# EAGLE design TPLE (EAGLE 6.4)
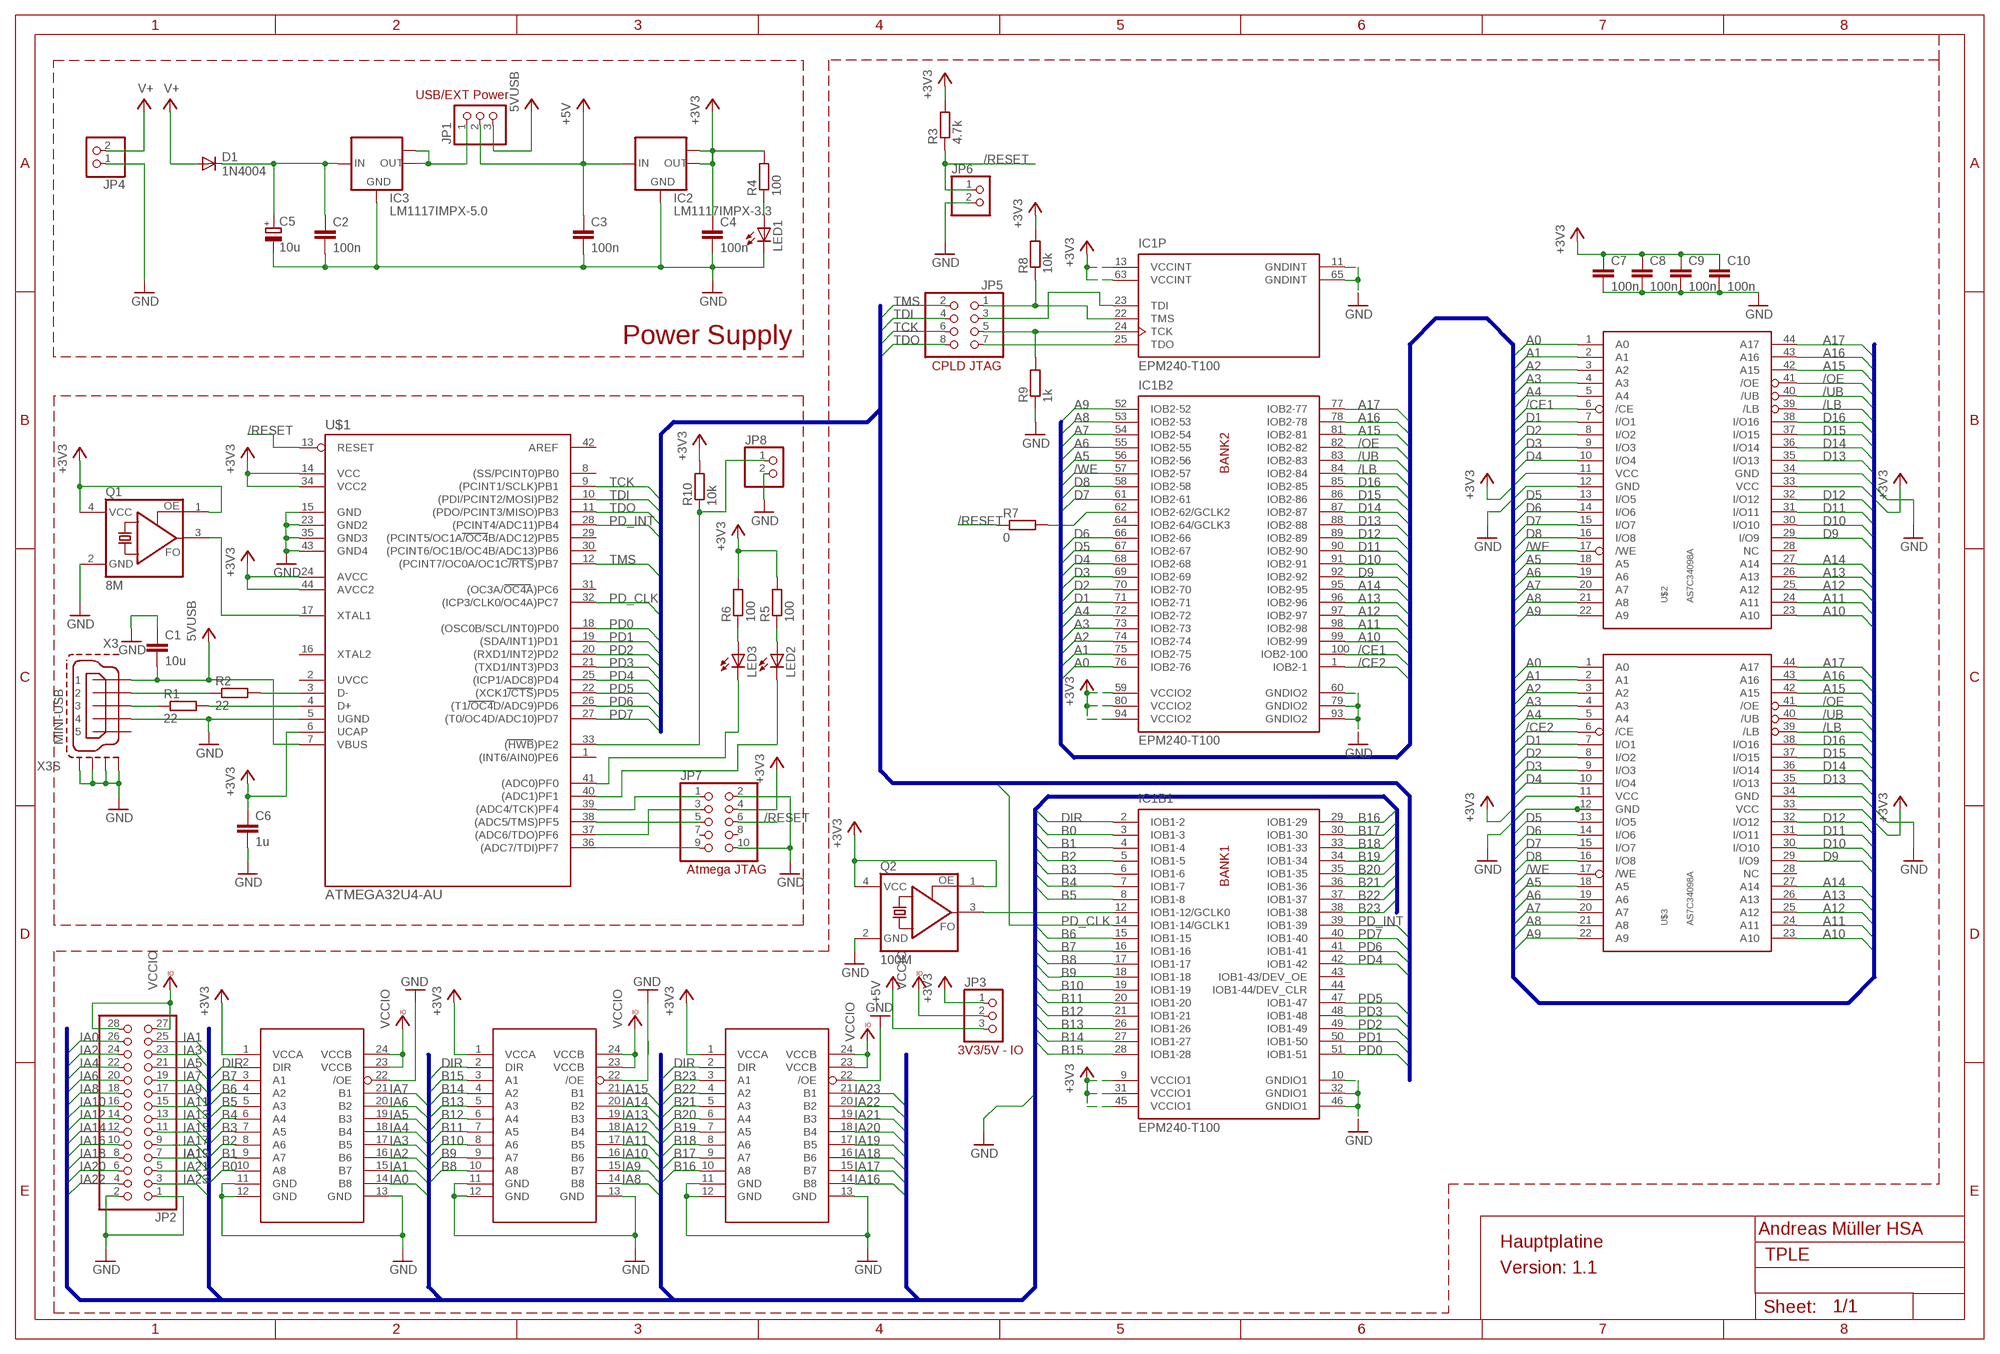
[diagram p0: schematic, sheet 1]

## Parts
C1  10u  C-EUC3216  [C3216]
C2  100n  C-EUC1206  [C1206]
C3  100n  C-EUC1206  [C1206]
C4  100n  C-EUC1206  [C1206]
C5  10u  CPOL-EUE2-5  [E2-5]
C6  1u  C-EUC0402  [C0402]
C7  100n  C-EUC0402  [C0402]
C8  100n  C-EUC0402  [C0402]
C9  100n  C-EUC0402  [C0402]
C10  100n  C-EUC0402  [C0402]
D1  1N4004  [DO41-10]
IC1  EPM240-T100  [TQFP100]
IC2  LM1117IMPX-3.3  [SOT223]
IC3  LM1117IMPX-5.0  [SOT223]
JP1  PINHD-1X3  [1X03]
JP2  PINHD-2X14  [2X14]
JP3  PINHD-1X3  [1X03]
JP4  PINHD-1X2  [1X02]
JP5  PINHD-2X4  [2X04]
JP6  PINHD-1X2  [1X02]
JP7  PINHD-2X5  [2X05]
JP8  PINHD-1X2  [1X02]
LED1  LEDSMT1206  [1206]
LED2  LEDSMT1206  [1206]
LED3  LEDSMT1206  [1206]
Q1  8M  ASFL1  [ASF]
Q2  100M  ASFL1  [ASF]
R1  22  R-EU_M3216  [M3216]
R2  22  R-EU_M3216  [M3216]
R3  4.7k  R-EU_M3216  [M3216]
R4  100  R-EU_M3216  [M3216]
R5  100  R-EU_M3216  [M3216]
R6  100  R-EU_M3216  [M3216]
R7  0  R-EU_R0201  [R0201]
R8  10k  R-EU_M3216  [M3216]
R9  1k  R-EU_M3216  [M3216]
R10  10k  R-EU_R0402  [R0402]
U$1  ATMEGA32U4-AU  [TQFP44]
U$2  AS7C34098A  [TSOP44-T2]
U$3  AS7C34098A  [TSOP44-T2]
U$4  SN74LVC8T245  [TVSOP24]
U$5  SN74LVC8T245  [TVSOP24]
U$6  SN74LVC8T245  [TVSOP24]
X3  MINI-USB  MINI-USB-SHIELD-UX60A-MB-5ST  [UX60A-MB-5ST]

## Nets
+3V3: C4.1 C6.1 C7.1 C8.1 C9.1 C10.1 IC1.9(B1:VCCIO1) IC1.13(P:VCCINT) IC1.31(B1:VCCIO1) IC1.45(B1:VCCIO1) IC1.59(B2:VCCIO2) IC1.63(P:VCCINT) IC1.80(B2:VCCIO2) IC1.94(B2:VCCIO2) IC2.2(OUT) IC2.TAB(OUT1) JP3.1 JP7.4 Q1.1(OE) Q1.4(VCC) Q2.1(OE) Q2.4(VCC) R3.2 R4.2 R5.2 R6.2 R8.2 R10.2 U$1.6(UCAP) U$1.14(VCC) U$1.24(AVCC) U$1.34(VCC2) U$1.44(AVCC2) U$2.11(VCC) U$2.33(VCC) U$3.11(VCC) U$3.33(VCC) U$4.1(VCCA) U$5.1(VCCA) U$6.1(VCCA)
+5V: C3.1 IC2.3(IN) JP1.2 JP3.3
/CE1: IC1.100(B2:IOB2-100) U$2.6(/CE)
/CE2: IC1.1(B2:IOB2-1) U$3.6(/CE)
/LB: IC1.84(B2:IOB2-84) U$2.39(/LB) U$3.39(/LB)
/OE: IC1.82(B2:IOB2-82) U$2.41(/OE) U$3.41(/OE)
/RESET: JP6.1 JP7.6 R3.1 R7.1 U$1.13(RESET)
/UB: IC1.83(B2:IOB2-83) U$2.40(/UB) U$3.40(/UB)
/WE: IC1.57(B2:IOB2-57) U$2.17(/WE) U$3.17(/WE)
A0: IC1.76(B2:IOB2-76) U$2.1(A0) U$3.1(A0)
A1: IC1.75(B2:IOB2-75) U$2.2(A1) U$3.2(A1)
A2: IC1.74(B2:IOB2-74) U$2.3(A2) U$3.3(A2)
A3: IC1.73(B2:IOB2-73) U$2.4(A3) U$3.4(A3)
A4: IC1.72(B2:IOB2-72) U$2.5(A4) U$3.5(A4)
A5: IC1.56(B2:IOB2-56) U$2.18(A5) U$3.18(A5)
A6: IC1.55(B2:IOB2-55) U$2.19(A6) U$3.19(A6)
A7: IC1.54(B2:IOB2-54) U$2.20(A7) U$3.20(A7)
A8: IC1.53(B2:IOB2-53) U$2.21(A8) U$3.21(A8)
A9: IC1.52(B2:IOB2-52) U$2.22(A9) U$3.22(A9)
A10: IC1.99(B2:IOB2-99) U$2.23(A10) U$3.23(A10)
A11: IC1.98(B2:IOB2-98) U$2.24(A11) U$3.24(A11)
A12: IC1.97(B2:IOB2-97) U$2.25(A12) U$3.25(A12)
A13: IC1.96(B2:IOB2-96) U$2.26(A13) U$3.26(A13)
A14: IC1.95(B2:IOB2-95) U$2.27(A14) U$3.27(A14)
A15: IC1.81(B2:IOB2-81) U$2.42(A15) U$3.42(A15)
A16: IC1.78(B2:IOB2-78) U$2.43(A16) U$3.43(A16)
A17: IC1.77(B2:IOB2-77) U$2.44(A17) U$3.44(A17)
B0: IC1.3(B1:IOB1-3) U$4.10(A8)
B1: IC1.4(B1:IOB1-4) U$4.9(A7)
B2: IC1.5(B1:IOB1-5) U$4.8(A6)
B3: IC1.6(B1:IOB1-6) U$4.7(A5)
B4: IC1.7(B1:IOB1-7) U$4.6(A4)
B5: IC1.8(B1:IOB1-8) U$4.5(A3)
B6: IC1.15(B1:IOB1-15) U$4.4(A2)
B7: IC1.16(B1:IOB1-16) U$4.3(A1)
B8: IC1.17(B1:IOB1-17) U$5.10(A8)
B9: IC1.18(B1:IOB1-18) U$5.9(A7)
B10: IC1.19(B1:IOB1-19) U$5.8(A6)
B11: IC1.20(B1:IOB1-20) U$5.7(A5)
B12: IC1.21(B1:IOB1-21) U$5.6(A4)
B13: IC1.26(B1:IOB1-26) U$5.5(A3)
B14: IC1.27(B1:IOB1-27) U$5.4(A2)
B15: IC1.28(B1:IOB1-28) U$5.3(A1)
B16: IC1.29(B1:IOB1-29) U$6.10(A8)
B17: IC1.30(B1:IOB1-30) U$6.9(A7)
B18: IC1.33(B1:IOB1-33) U$6.8(A6)
B19: IC1.34(B1:IOB1-34) U$6.7(A5)
B20: IC1.35(B1:IOB1-35) U$6.6(A4)
B21: IC1.36(B1:IOB1-36) U$6.5(A3)
B22: IC1.37(B1:IOB1-37) U$6.4(A2)
B23: IC1.38(B1:IOB1-38) U$6.3(A1)
D1: IC1.71(B2:IOB2-71) U$2.7(I/O1) U$3.7(I/O1)
D2: IC1.70(B2:IOB2-70) U$2.8(I/O2) U$3.8(I/O2)
D3: IC1.69(B2:IOB2-69) U$2.9(I/O3) U$3.9(I/O3)
D4: IC1.68(B2:IOB2-68) U$2.10(I/O4) U$3.10(I/O4)
D5: IC1.67(B2:IOB2-67) U$2.13(I/O5) U$3.13(I/O5)
D6: IC1.66(B2:IOB2-66) U$2.14(I/O6) U$3.14(I/O6)
D7: IC1.61(B2:IOB2-61) U$2.15(I/O7) U$3.15(I/O7)
D8: IC1.58(B2:IOB2-58) U$2.16(I/O8) U$3.16(I/O8)
D9: IC1.92(B2:IOB2-92) U$2.29(I/O9) U$3.29(I/O9)
D10: IC1.91(B2:IOB2-91) U$2.30(I/O10) U$3.30(I/O10)
D11: IC1.90(B2:IOB2-90) U$2.31(I/O11) U$3.31(I/O11)
D12: IC1.89(B2:IOB2-89) U$2.32(I/O12) U$3.32(I/O12)
D13: IC1.88(B2:IOB2-88) U$2.35(I/O13) U$3.35(I/O13)
D14: IC1.87(B2:IOB2-87) U$2.36(I/O14) U$3.36(I/O14)
D15: IC1.86(B2:IOB2-86) U$2.37(I/O15) U$3.37(I/O15)
D16: IC1.85(B2:IOB2-85) U$2.38(I/O16) U$3.38(I/O16)
DIR: IC1.2(B1:IOB1-2) U$4.2(DIR) U$5.2(DIR) U$6.2(DIR)
GND: C1.1 C2.2 C3.2 C4.2 C5.- C6.2 C7.2 C8.2 C9.2 C10.2 IC1.10(B1:GNDIO1) IC1.11(P:GNDINT) IC1.32(B1:GNDIO1) IC1.46(B1:GNDIO1) IC1.60(B2:GNDIO2) IC1.65(P:GNDINT) IC1.79(B2:GNDIO2) IC1.93(B2:GNDIO2) IC2.1(GND) IC3.1(GND) JP2.1 JP2.2 JP4.1 JP6.2 JP7.2 JP7.10 JP8.2 LED1.C Q1.2(GND) Q2.2(GND) R9.1 U$1.5(UGND) U$1.15(GND) U$1.23(GND2) U$1.35(GND3) U$1.43(GND4) U$2.12(GND) U$2.34(GND) U$3.12(GND) U$3.34(GND) U$4.11(GND) U$4.12(GND) U$4.13(GND) U$4.22(/OE) U$5.11(GND) U$5.12(GND) U$5.13(GND) U$5.22(/OE) U$6.11(GND) U$6.12(GND) U$6.13(GND) U$6.22(/OE) X3.4 X3.M1(S1) X3.M2(S2) X3.M3(S3) X3.M4(S4)
IA0: JP2.26 U$4.14(B8)
IA1: JP2.25 U$4.15(B7)
IA2: JP2.24 U$4.16(B6)
IA3: JP2.23 U$4.17(B5)
IA4: JP2.22 U$4.18(B4)
IA5: JP2.21 U$4.19(B3)
IA6: JP2.20 U$4.20(B2)
IA7: JP2.19 U$4.21(B1)
IA8: JP2.18 U$5.14(B8)
IA9: JP2.17 U$5.15(B7)
IA10: JP2.16 U$5.16(B6)
IA11: JP2.15 U$5.17(B5)
IA12: JP2.14 U$5.18(B4)
IA13: JP2.13 U$5.19(B3)
IA14: JP2.12 U$5.20(B2)
IA15: JP2.11 U$5.21(B1)
IA16: JP2.10 U$6.14(B8)
IA17: JP2.9 U$6.15(B7)
IA18: JP2.8 U$6.16(B6)
IA19: JP2.7 U$6.17(B5)
IA20: JP2.6 U$6.18(B4)
IA21: JP2.5 U$6.19(B3)
IA22: JP2.4 U$6.20(B2)
IA23: JP2.3 U$6.21(B1)
N$2: R2.1 X3.2
N$3: R2.2 U$1.3(D-)
N$4: R1.1 X3.3
N$5: R1.2 U$1.4(D+)
N$6: IC3.2(OUT) IC3.TAB(OUT1) JP1.1
N$7: IC1.23(P:TDI) JP5.3
N$8: C2.1 C5.+ D1.C IC3.3(IN)
N$9: IC1.22(P:TMS) JP5.1 R8.1
N$10: IC1.24(P:TCK) JP5.5 R9.2
N$11: IC1.25(P:TDO) JP5.7
N$13: JP7.1 U$1.39((ADC4/TCK)PF4)
N$14: JP7.3 U$1.37((ADC6/TDO)PF6)
N$15: JP7.5 U$1.38((ADC5/TMS)PF5)
N$16: JP7.9 U$1.36((ADC7/TDI)PF7)
N$17: IC1.62(B2:IOB2-62/GCLK2) R7.2
N$18: JP8.1 R10.1 U$1.33((HWB)PE2)
N$23: Q1.3(FO) U$1.17(XTAL1)
N$24: IC1.12(B1:IOB1-12/GCLK0) Q2.3(FO)
N$25: LED1.A R4.1
N$26: LED2.C U$1.40((ADC1)PF1)
N$27: LED3.C U$1.41((ADC0)PF0)
N$28: LED2.A R5.1
N$29: LED3.A R6.1
PD0: IC1.51(B1:IOB1-51) U$1.18((OSC0B/SCL/INT0)PD0)
PD1: IC1.50(B1:IOB1-50) U$1.19((SDA/INT1)PD1)
PD2: IC1.49(B1:IOB1-49) U$1.20((RXD1/INT2)PD2)
PD3: IC1.48(B1:IOB1-48) U$1.21((TXD1/INT3)PD3)
PD4: IC1.42(B1:IOB1-42) U$1.25((ICP1/ADC8)PD4)
PD5: IC1.47(B1:IOB1-47) U$1.22((XCK1/CTS)PD5)
PD6: IC1.41(B1:IOB1-41) U$1.26((T1/OC4D/ADC9)PD6)
PD7: IC1.40(B1:IOB1-40) U$1.27((T0/OC4D/ADC10)PD7)
PD_CLK: IC1.14(B1:IOB1-14/GCLK1) U$1.32((ICP3/CLK0/OC4A)PC7)
PD_INT: IC1.39(B1:IOB1-39) U$1.28((PCINT4/ADC11)PB4)
TCK: JP5.6 U$1.9((PCINT1/SCLK)PB1)
TDI: JP5.4 U$1.10((PDI/PCINT2/MOSI)PB2)
TDO: JP5.8 U$1.11((PDO/PCINT3/MISO)PB3)
TMS: JP5.2 U$1.12((PCINT7/OC0A/OC1C/RTS)PB7)
V+: D1.A JP4.2
VCC: C1.2 JP1.3 U$1.7(VBUS) X3.1 ; supply symbol labelled 5VUSB
VCCIO: JP2.27 JP2.28 JP3.2 U$4.23(VCCB) U$4.24(VCCB) U$5.23(VCCB) U$5.24(VCCB) U$6.23(VCCB) U$6.24(VCCB)
Unconnected: IC1.43(B1:IOB1-43/DEV_OE) IC1.44(B1:IOB1-44/DEV_CLR) IC1.64(B2:IOB2-64/GCLK3) JP7.7 JP7.8 U$1.1((INT6/AIN0)PE6) U$1.2(UVCC) U$1.8((SS/PCINT0)PB0) U$1.16(XTAL2) U$1.29((PCINT5/OC1A/OC4B/ADC12)PB5) U$1.30((PCINT6/OC1B/OC4B/ADC13)PB6) U$1.31((OC3A/OC4A)PC6) U$1.42(AREF) U$2.28(NC) U$3.28(NC) X3.5

## Buses
A[0..17],D[1..16],/WE,/LB,/UB,/OE,/CE1,/CE2
PD[0..7],PD_CLK,PD_INT,TDI,TMS,TCK,TDO
IA[0..23],B[0..23],DIR,\OE

## Notes on the sheet
- USB/EXT Power
- Power Supply
- CPLD JTAG
- Atmega JTAG
- 3V3/5V - IO
- Andreas Müller HSA
- Hauptplatine
- Version: 1.1

## Library data of the parts
C1-C4 C6-C10 = rcl:C-EU: CAPACITOR, European symbol
C5 = rcl:CPOL-EU: POLARIZED CAPACITOR, European symbol
D1 = diode:1N4004: DIODE general purpose rectifier, 1 A
IC1 = altera-max2:EPM240-T100: Altera MAX II CPLD - EPM240 TQFP-100 Device EPM240 from Altera MAX II Family Feature EPM240 LEs 240 Typical Equivalent Macrocells 192 Equivalent Macrocell Range 128 ... 240 UFM Size (bits) 8192 User I/O pins 80 tPD1 (ns) 4.7 fCNT (MHz) 304 tSU (ns) 1.7 tCO (ns) 4.3
IC2 IC3 = lm1117:LM1117IMPX-*
JP1 JP3 = pinhead:PINHD-1X3: PIN HEADER
JP2 = pinhead:PINHD-2X14: PIN HEADER
JP4 JP6 JP8 = pinhead:PINHD-1X2: PIN HEADER
JP5 = pinhead:PINHD-2X4: PIN HEADER
JP7 = pinhead:PINHD-2X5: PIN HEADER
LED1-LED3 = led:LED: LED OSRAM: - CHIPLED LG R971, LG N971, LY N971, LG Q971, LY Q971, LO R971, LY R971 LH N974, LH R974 LS Q976, LO Q976, LY Q976 LO Q996 - Hyper CHIPLED LW Q18S LB Q993, LB Q99A, LB R99A - SideLED LS A670, LO A670, LY A670, LG A670, LP A670 LB A673, LV A673, LT A673, LW A673 LH A674 LY A675 LS A676, LA A676, LO A676, LY A676, LW A676 LS A679, LY A679, LG A679 - Hyper Micro SIDELED® LS Y876, LA Y876, LO Y876, LY Y876 LT Y87S - SmartLED LW L88C, LW L88S LB L89C, LB L89S, LG L890 LS L89K, LO L89K, LY L89K LS L896, LA L896, LO L896, LY L896 - TOPLED LS T670, LO T670, LY T670, LG T670, LP T670 LSG T670, LSP T670, LSY T670, LOP T670, LYG T670 LG T671, LOG T671, LSG T671 LB T673, LV T673, LT T673, LW T673 LH T674 LS T676, LA T676, LO T676, LY T676, LB T676, LH T676, LSB T676, LW T676 LB T67C, LV T67C, LT T67C, LS T67K, LO T67K, LY T67K, LW E67C LS E67B, LA E67B, LO E67B, LY E67B, LB E67C, LV E67C, LT E67C LW T67C LS T679, LY T679, LG T679 LS T770, LO T770, LY T770, LG T770, LP T770 LB T773, LV T773, LT T773, LW T773 LH T774 LS E675, LA E675, LY E675, LS T675 LS T776, LA T776, LO T776, LY T776, LB T776 LHGB T686 LT T68C, LB T68C - Hyper Mini TOPLED® LB M676 - Mini TOPLED Santana® LG M470 LS M47K, LO M47K, LY M47K Source: http://www.osram.convergy.de LUXEON: - LUMILED® LXK2-PW12-R00, LXK2-PW12-S00, LXK2-PW14-U00, LXK2-PW14-V00 LXK2-PM12-R00, LXK2-PM12-S00, LXK2-PM14-U00 LXK2-PE12-Q00, LXK2-PE12-R00, LXK2-PE12-S00, LXK2-PE14-T00, LXK2-PE14-U00 LXK2-PB12-K00, LXK2-PB12-L00, LXK2-PB12-M00, LXK2-PB14-N00, LXK2-PB14-P00, LXK2-PB14-Q00 LXK2-PR12-L00, LXK2-PR12-M00, LXK2-PR14-Q00, LXK2-PR14-R00 LXK2-PD12-Q00, LXK2-PD12-R00, LXK2-PD12-S00 LXK2-PH12-R00, LXK2-PH12-S00 LXK2-PL12-P00, LXK2-PL12-Q00, LXK2-PL12-R00 Source: www.luxeon.com KINGBRIGHT: KA-3528ASYC Source: www.kingbright.com
Q1 Q2 = crystal:ASF*: CRYSTAL CLOCK OSCILLATORS 5.0 Vdc or 3.3 Vdc - LOW PROFILE ULTRA MINIATURE CERAMIC SURFACE MOUNT Source: http://www.abracon.com/Oscillators/asf1-L-L1.pdf
R1-R6 R8 R9 = resistor:R-EU_: RESISTOR, European symbol
R7 R10 = rcl:R-EU_: RESISTOR, European symbol
U$1 = mega32U4:ATMEGA32U4-AU
U$2 U$3 = as7c34098a:AS7C34098A
U$4-U$6 = sn47lvc:SN74LVC8T245
X3 = con-hirose:MINI-USB-SHIELD-: MINI USB Connector Source: http://www.hirose.co.jp/cataloge_hp/e24000019.pdf

## Board
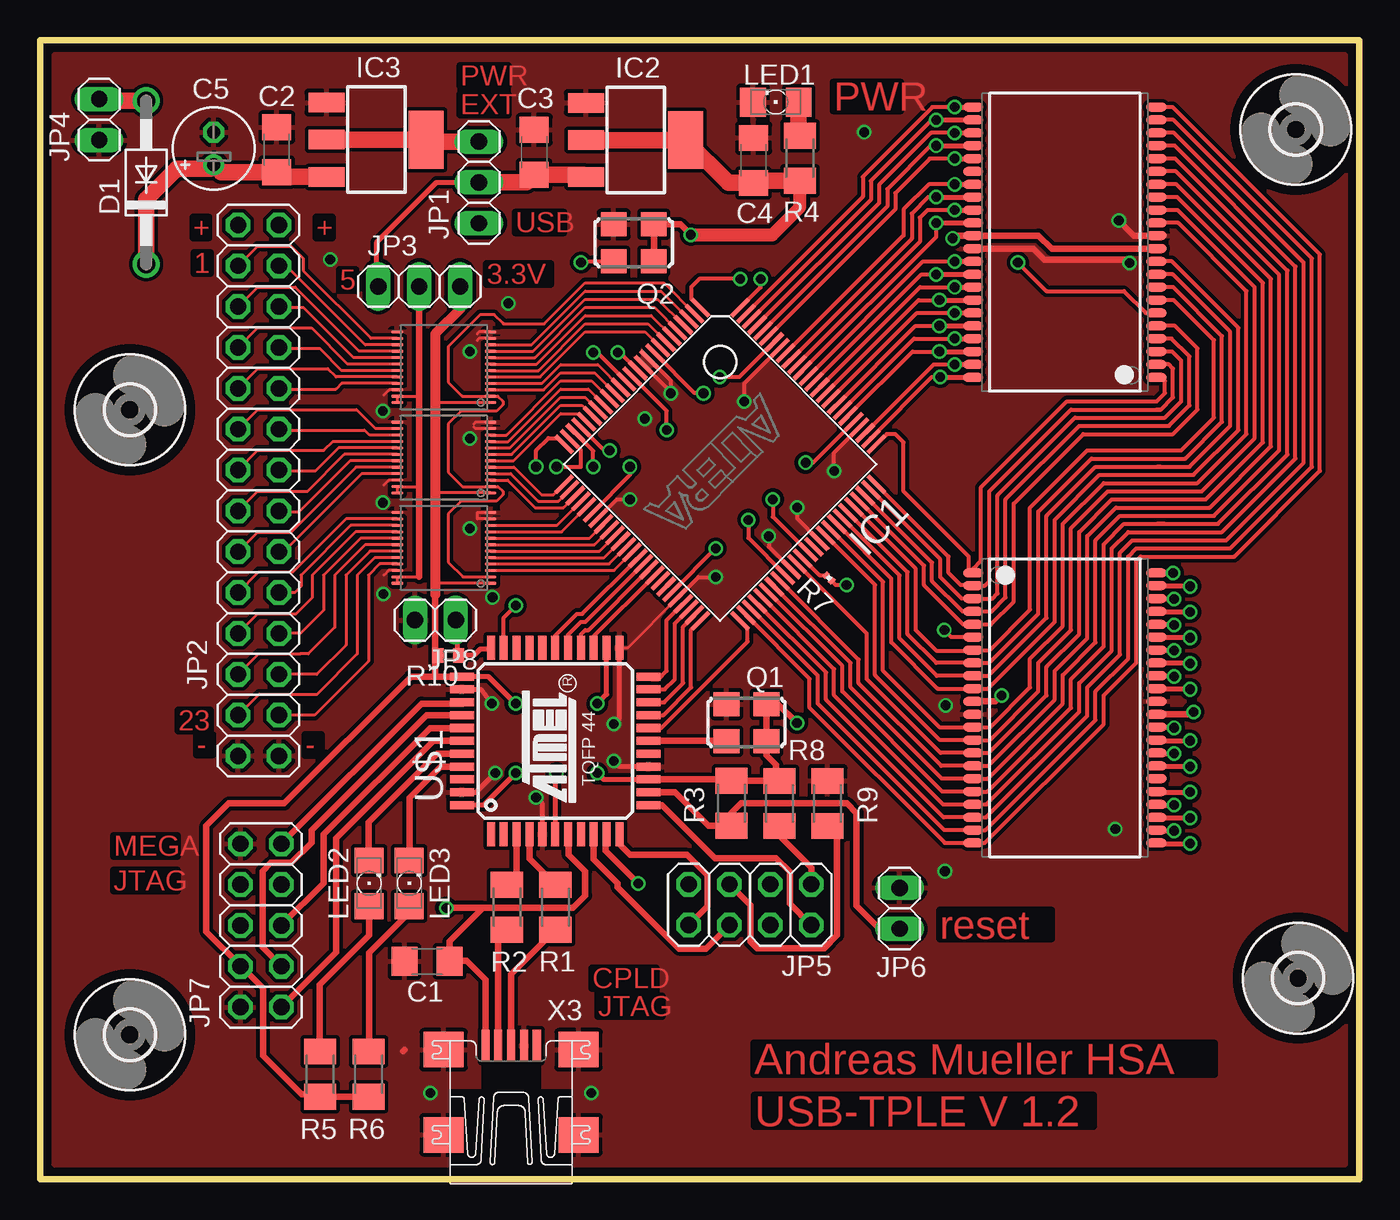
[diagram p1: board, top side]
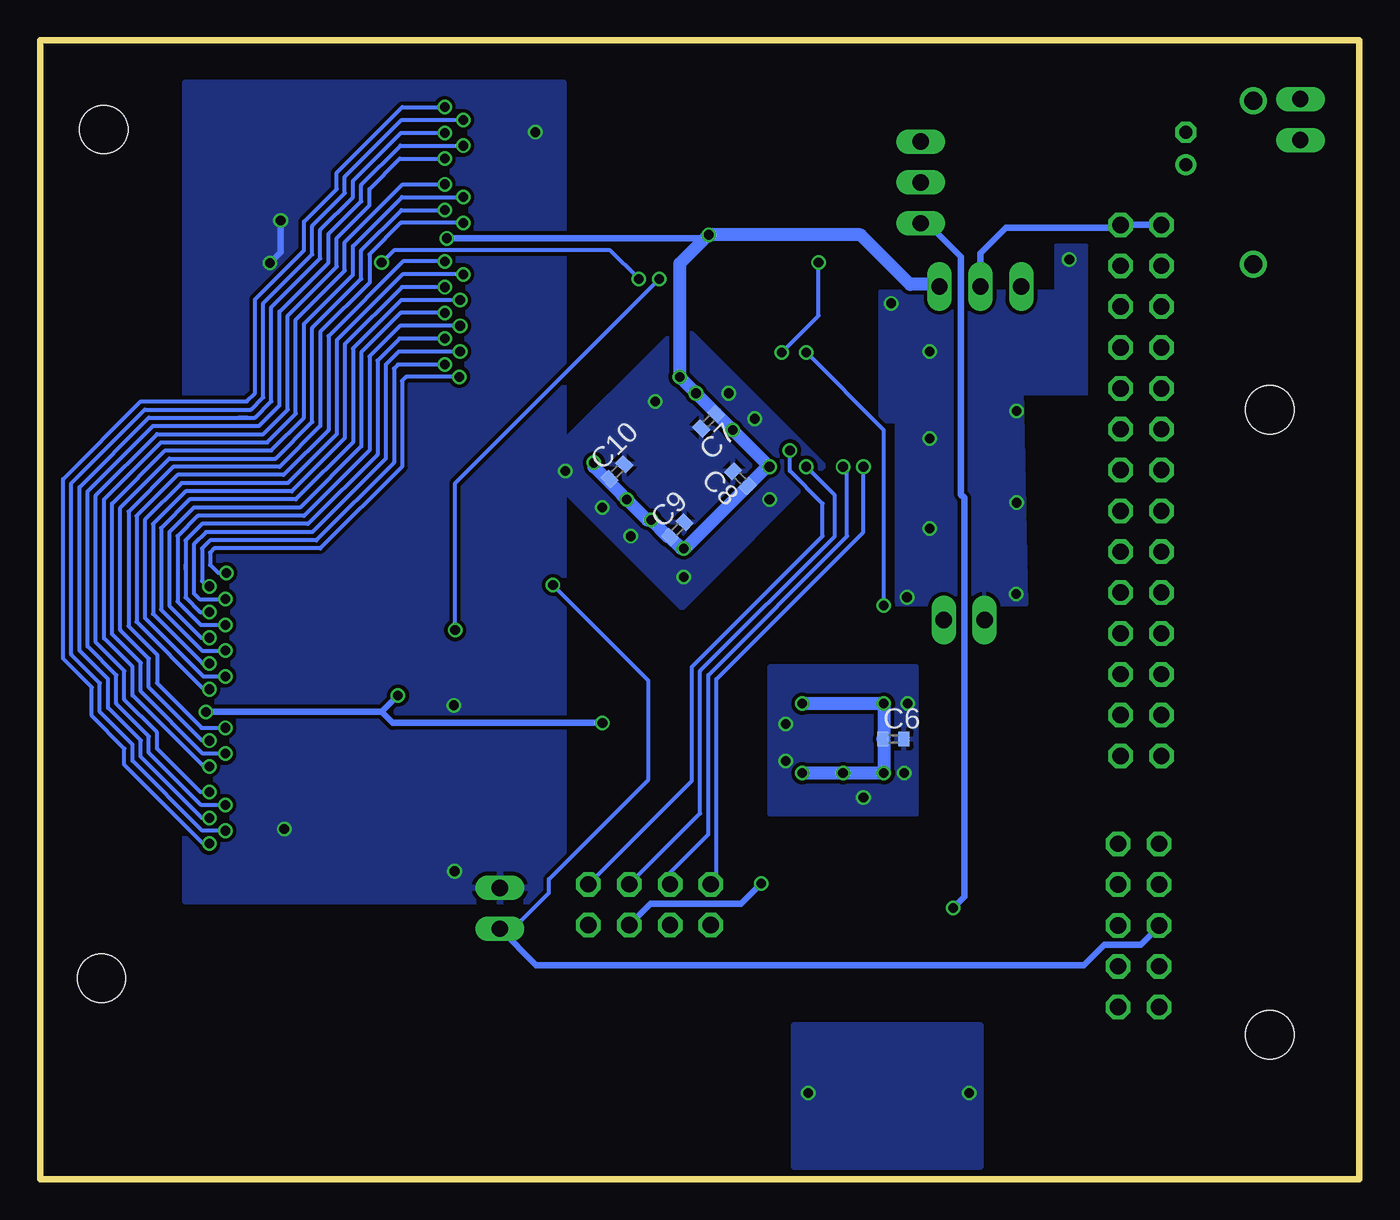
[diagram p2: board, bottom side, seen from below]

Size 82.06 x 70.84 mm. Coordinates in mm from the lower left corner, seen from the top.
Outline: 0,70.84 82.06,70.84 82.06,0 0,0 0,70.84
Copper layers (1*16): Top 0.035mm / dielectric 1.5mm / Bottom 0.035mm
Design rules "PropagandaPCB *": minimum track width 9mil, minimum drill 9mil, track to track 9mil, track to pad 9mil, pad to pad 9mil, via to via 9mil, smd to smd 9mil, copper to edge 10mil, drill to drill 10mil, minimum pad ring 10mil, minimum via ring 6mil, stop-mask expansion 2mil, vias tented up to drill 100mil, thermal gap 10mil

### Footprints (pad centres in the part's own frame; a part is rotated, then mirrored left to right if it is on the bottom)
C3216 = smd 1.6 x 1.8: 1 -1.4,0; 2 1.4,0
C1206 = smd 1.6 x 1.8: 1 -1.4,0; 2 1.4,0
E2-5 = drill 0.813 pad 1.27: + -1.016,0 | drill 0.813 pad 1.27 octagon: - 1.016,0
C0402 = smd 0.7 x 0.9: 1 -0.65,0; 2 0.65,0
DO41-10 = drill 1.118: A 5.08,0; C -5.08,0
TQFP100 = smd 0.27 x 1.5: 1 -6,-7.75; 2 -5.5,-7.75; 3 -5,-7.75; 4 -4.5,-7.75; 5 -4,-7.75; 6 -3.5,-7.75; 7 -3,-7.75; 8 -2.5,-7.75; 9 -2,-7.75; 10 -1.5,-7.75; 11 -1,-7.75; 12 -0.5,-7.75; 13 0,-7.75; 14 0.5,-7.75; 15 1,-7.75; 16 1.5,-7.75; 17 2,-7.75; 18 2.5,-7.75; 19 3,-7.75; 20 3.5,-7.75; 21 4,-7.75; 22 4.5,-7.75; 23 5,-7.75; 24 5.5,-7.75; 25 6,-7.75; 51 6,7.75; 52 5.5,7.75; 53 5,7.75; 54 4.5,7.75; 55 4,7.75; 56 3.5,7.75; 57 3,7.75; 58 2.5,7.75; 59 2,7.75; 60 1.5,7.75; 61 1,7.75; 62 0.5,7.75; 63 0,7.75; 64 -0.5,7.75; 65 -1,7.75; 66 -1.5,7.75; 67 -2,7.75; 68 -2.5,7.75; 69 -3,7.75; 70 -3.5,7.75; 71 -4,7.75; 72 -4.5,7.75; 73 -5,7.75; 74 -5.5,7.75; 75 -6,7.75 | smd 1.5 x 0.27: 26 7.75,-6; 27 7.75,-5.5; 28 7.75,-5; 29 7.75,-4.5; 30 7.75,-4; 31 7.75,-3.5; 32 7.75,-3; 33 7.75,-2.5; 34 7.75,-2; 35 7.75,-1.5; 36 7.75,-1; 37 7.75,-0.5; 38 7.75,0; 39 7.75,0.5; 40 7.75,1; 41 7.75,1.5; 42 7.75,2; 43 7.75,2.5; 44 7.75,3; 45 7.75,3.5; 46 7.75,4; 47 7.75,4.5; 48 7.75,5; 49 7.75,5.5; 50 7.75,6; 76 -7.75,6; 77 -7.75,5.5; 78 -7.75,5; 79 -7.75,4.5; 80 -7.75,4; 81 -7.75,3.5; 82 -7.75,3; 83 -7.75,2.5; 84 -7.75,2; 85 -7.75,1.5; 86 -7.75,1; 87 -7.75,0.5; 88 -7.75,0; 89 -7.75,-0.5; 90 -7.75,-1; 91 -7.75,-1.5; 92 -7.75,-2; 93 -7.75,-2.5; 94 -7.75,-3; 95 -7.75,-3.5; 96 -7.75,-4; 97 -7.75,-4.5; 98 -7.75,-5; 99 -7.75,-5.5; 100 -7.75,-6
SOT223 = smd 1.219 x 2.235: 1 -2.311,-3.099; 2 0,-3.099; 3 2.311,-3.099 | smd 3.6 x 2.2: TAB 0,3.099
1X03 = drill 1.016 long: 1 -2.54,0; 2 0,0; 3 2.54,0
2X14 = drill 1.016 octagon: 1 -16.51,-1.27; 2 -16.51,1.27; 3 -13.97,-1.27; 4 -13.97,1.27; 5 -11.43,-1.27; 6 -11.43,1.27; 7 -8.89,-1.27; 8 -8.89,1.27; 9 -6.35,-1.27; 10 -6.35,1.27; 11 -3.81,-1.27; 12 -3.81,1.27; 13 -1.27,-1.27; 14 -1.27,1.27; 15 1.27,-1.27; 16 1.27,1.27; 17 3.81,-1.27; 18 3.81,1.27; 19 6.35,-1.27; 20 6.35,1.27; 21 8.89,-1.27; 22 8.89,1.27; 23 11.43,-1.27; 24 11.43,1.27; 25 13.97,-1.27; 26 13.97,1.27; 27 16.51,-1.27; 28 16.51,1.27
1X02 = drill 1.016 long: 1 -1.27,0; 2 1.27,0
2X04 = drill 1.016 octagon: 1 -3.81,-1.27; 2 -3.81,1.27; 3 -1.27,-1.27; 4 -1.27,1.27; 5 1.27,-1.27; 6 1.27,1.27; 7 3.81,-1.27; 8 3.81,1.27
2X05 = drill 1.016 octagon: 1 -5.08,-1.27; 2 -5.08,1.27; 3 -2.54,-1.27; 4 -2.54,1.27; 5 0,-1.27; 6 0,1.27; 7 2.54,-1.27; 8 2.54,1.27; 9 5.08,-1.27; 10 5.08,1.27
1206 = smd 1.6 x 1.803: A -1.422,0; C 1.422,0
ASF = smd 1.6 x 1.5: 1 -1.25,-1.15; 2 1.25,-1.15; 3 1.25,1.15; 4 -1.25,1.15
M3216 = smd 1.6 x 2: 1 -1.4,0; 2 1.4,0
R0201 = smd 0.28 x 0.43: 1 -0.255,0; 2 0.255,0
R0402 = smd 0.7 x 0.9: 1 -0.65,0; 2 0.65,0
TQFP44 = smd 1.5 x 0.5: 1 -5.8,4; 2 -5.8,3.2; 3 -5.8,2.4; 4 -5.8,1.6; 5 -5.8,0.8; 6 -5.8,0; 7 -5.8,-0.8; 8 -5.8,-1.6; 9 -5.8,-2.4; 10 -5.8,-3.2; 11 -5.8,-4; 23 5.8,-4; 24 5.8,-3.2; 25 5.8,-2.4; 26 5.8,-1.6; 27 5.8,-0.8; 28 5.8,0; 29 5.8,0.8; 30 5.8,1.6; 31 5.8,2.4; 32 5.8,3.2; 33 5.8,4 | smd 0.5 x 1.5: 12 -4,-5.8; 13 -3.2,-5.8; 14 -2.4,-5.8; 15 -1.6,-5.8; 16 -0.8,-5.8; 17 0,-5.8; 18 0.8,-5.8; 19 1.6,-5.8; 20 2.4,-5.8; 21 3.2,-5.8; 22 4,-5.8; 34 4,5.8; 35 3.2,5.8; 36 2.4,5.8; 37 1.6,5.8; 38 0.8,5.8; 39 0,5.8; 40 -0.8,5.8; 41 -1.6,5.8; 42 -2.4,5.8; 43 -3.2,5.8; 44 -4,5.8
TSOP44-T2 = smd 1.25 x 0.55: 1 -5.7,8.4; 2 -5.7,7.6; 3 -5.7,6.8; 4 -5.7,6; 5 -5.7,5.2; 6 -5.7,4.4; 7 -5.7,3.6; 8 -5.7,2.8; 9 -5.7,2; 10 -5.7,1.2; 11 -5.7,0.4; 12 -5.7,-0.4; 13 -5.7,-1.2; 14 -5.7,-2; 15 -5.7,-2.8; 16 -5.7,-3.6; 17 -5.7,-4.4; 18 -5.7,-5.2; 19 -5.7,-6; 20 -5.7,-6.8; 21 -5.7,-7.6; 22 -5.7,-8.4; 23 5.7,-8.4; 24 5.7,-7.6; 25 5.7,-6.8; 26 5.7,-6; 27 5.7,-5.2; 28 5.7,-4.4; 29 5.7,-3.6; 30 5.7,-2.8; 31 5.7,-2; 32 5.7,-1.2; 33 5.7,-0.4; 34 5.7,0.4; 35 5.7,1.2; 36 5.7,2; 37 5.7,2.8; 38 5.7,3.6; 39 5.7,4.4; 40 5.7,5.2; 41 5.7,6; 42 5.7,6.8; 43 5.7,7.6; 44 5.7,8.4
TVSOP24 = smd 0.75 x 0.203: 1 -3,2.2; 2 -3,1.8; 3 -3,1.4; 4 -3,1; 5 -3,0.6; 6 -3,0.2; 7 -3,-0.2; 8 -3,-0.6; 9 -3,-1; 10 -3,-1.4; 11 -3,-1.8; 12 -3,-2.2; 13 2.8,-2.2; 14 2.8,-1.8; 15 2.8,-1.4; 16 2.8,-1; 17 2.8,-0.6; 18 2.8,-0.2; 19 2.8,0.2; 20 2.8,0.6; 21 2.8,1; 22 2.8,1.4; 23 2.8,1.8; 24 2.8,2.2
3,0 = hole 3: 0,0
UX60A-MB-5ST = smd 2 x 0.5: 1 2.25,1.6; 2 2.25,0.8; 3 2.25,0; 4 2.25,-0.8; 5 2.25,-1.6 | smd 2.2 x 2.5: M1 -3.3,-4.2; M2 -3.3,4.2; M3 2,4.2; M4 2,-4.2

### Placement (x,y rotation side)
C1  24.07,13.56 0 top
C2  14.71,64.03 90 top
C3  30.74,63.87 90 top
C4  44.38,63.36 90 top
C5  10.8,64.11 90 top
C6  28.99,27.38 0 bottom
C7  40.47,47.16 225 bottom
C8  38.5,43.58 135 bottom
C9  42.43,40.41 45 bottom
C10  46.18,44.01 45 bottom
D1  6.6,61.99 90 top
IC1  42.3,44.47 225 top
IC2  37.05,64.63 270 top
IC3  20.91,64.65 270 top
JP1  27.29,62 270 top
JP2  13.58,42.84 90 top
JP3  23.58,55.53 180 top
JP4  3.67,65.9 90 top
JP5  44.15,17.08 180 top
JP6  53.46,16.85 90 top
JP7  13.73,15.79 90 top
JP8  24.58,34.78 180 top
LED1  45.76,66.99 180 top
LED2  20.46,18.41 90 top
LED3  22.96,18.41 90 top
Q1  43.94,28.4 180 top
Q2  36.93,58.24 180 top
R1  32.05,16.92 90 top
R2  29.03,16.92 90 top
R3  43,23.39 90 top
R4  47.26,63.49 270 top
R5  17.42,6.54 270 top
R6  20.42,6.54 270 top
R7  49.06,37.4 135 top
R8  45.98,23.38 90 top
R9  48.98,23.38 270 top
R10  25.38,32.58 180 top
U$1  32.04,27.27 90 top
U$2  63.74,58.28 180 top
U$3  63.74,29.32 0 top
U$4  25.02,50.5 180 top
U$5  25.02,44.88 180 top
U$6  25.02,39.27 180 top
U$7  [3,0]  5.58,8.99 0 top
U$8  [3,0]  78.25,12.51 0 top
U$9  [3,0]  78.11,65.29 0 top
U$10  [3,0]  5.58,47.86 0 top
X3  29.29,6.07 90 top

### Tracks (layer width: path | path; a pad name or v marks a point on that pad's centre or on a via)
+3V3  (via drill 0.6)
  Top 0.2: U$4.1 24.58,48.3 24.58,48.58 | U$5.1 24.58,42.68 24.58,42.98 | U$6.1 24.58,37.07 24.58,37.38
  Top 0.254: IC1.13 38.98,47.8 v38.98,46.6 | IC1.9 40.72,48.89 v41.26,48.89 | IC1.31 36.69,43.8 v36.69,44.31 | IC1.45 v42.02,39.23 | IC1.59 44.06,39.89 v44.06,41.01 | IC1.63 45.58,41.19 v45.58,42.28 | IC1.80 48.06,44.57 v47.61,44.57 | IC1.94 43.5,49.9 v42.28,49.9
  Top 0.305: v29.58,29.58 27.89,31.27 U$1.34 | U$1.24 35.24,30.16 v34.66,29.58 | U$1.14 35.05,24.87 v34.66,25.26 | U$1.44 27.58,23.27 v29.58,25.26 | U$1.6 32.04,25.18 v32.12,25.26 | Q2.1 | R10.2 24.58,32.58
  Top 0.406: U$3.33 71.59,28.92 v71.74,29.07 | v59.8,30.09 59.43,29.72 U$3.11 | U$2.11 69.42,57.86 62.92,57.86 62.1,58.68 U$2.33 56.92,58.68 v56.76,58.52 | v40.48,58.74 39.83,59.39 Q2.1 Q2.4 | v47.08,28.38 45.91,29.55 Q1.1 Q1.4 45.19,26.37 45.78,25.78 45.78,24.98 R8.2 | R6.2 R5.2 17.28,5.28 16.28,5.28 13.86,7.7 13.86,11.88 12.49,13.25 JP7.4 12.46,13.28 10.34,15.4 10.34,21.98 11.74,23.38 15.18,23.38 23.07,31.27 24.58,31.27 | 45.98,24.99 R8.2 | U$1.14 42.92,24.87 R3.2 R8.2 | 24.58,36.38 24.58,32.58 24.58,31.27 | 24.58,31.27 U$1.34
  Top 0.61: JP3.1 26.18,55.46 26.18,54.18 24.58,52.58 24.58,48.58 24.58,42.98 24.58,37.38 24.58,36.38
  Top 0.813: R4.2 47.26,60.46 45.54,58.74 v40.48,58.74
  Top 1.016: IC2.2 IC2.TAB 42.82,61.96 C4.1 44.51,62.09 R4.2
  Bottom 0.254: 40.01,47.64 C7.1 | v36.69,44.31 36.85,44.31 | 41.93,39.23 v42.02,39.23 42.18,39.23 | C9.1 42.99,39.95 | v44.06,41.01 44.31,41.01 | v45.58,42.28 45.83,42.54 46.64,43.34 C10.1 | 47.61,44.31 v47.61,44.57
  Bottom 0.406: 60.82,29.07 v71.74,29.07 | 60.82,29.07 v59.8,30.09 | v56.76,58.52 40.7,58.52 v40.48,58.74 | v47.08,28.38 60.13,28.38 60.82,29.07
  Bottom 0.61: 29.58,29.6 v29.58,29.58
  Bottom 0.813: v36.69,44.31 v38.98,46.6 40.01,47.64 v41.26,48.89 v42.28,49.9 42.28,56.94 v40.48,58.74 31.02,58.74 27.94,55.66 26.25,55.66 JP3.1 | 36.85,44.31 C8.1 41.93,39.23 | 42.18,39.23 C9.1 | 42.99,39.95 v44.06,41.01 | 44.31,41.01 v45.58,42.28 | 45.83,42.54 47.61,44.31 | v34.66,29.58 v29.58,29.58 29.58,27.44 C6.1 29.58,27.32 v29.58,25.26 v32.12,25.26 v34.66,25.26
+5V
  Top 0.305: JP1.2 24.66,62 20.94,58.28 20.94,55.62 JP3.3
  Top 1.016: JP1.2 30.26,62 C3.1 33.8,62.47 IC2.3
/CE1  (via drill 0.6)
  Top 0.254: U$2.6 68.78,53.88 67.42,55.24 62.6,55.24 v60.82,57.01 | v44.82,56 44.82,55.47 IC1.100
  Bottom 0.254: v60.82,57.01 60.06,57.78 46.6,57.78 v44.82,56
/CE2  (via drill 0.6)
  Top 0.254: U$3.6 56.68,33.72 v56.25,34.15 | v43.55,56 41.01,56 40.5,55.49 40.5,54.76 IC1.1
  Bottom 0.254: v56.25,34.15 56.25,43.3 v43.55,56
/LB  (via drill 0.6)
  Top 0.254: v56.89,53.88 54.54,53.88 IC1.84
  Top 0.305: v56.89,53.88 U$2.39 | U$3.39 69.48,33.68 v71.54,33.68
  Bottom 0.254: v56.89,53.88 59.64,53.88 62.09,51.43 62.09,45.58 65.9,41.77 72.5,41.77 74.03,40.25 74.03,35.68 72.03,33.68 v71.54,33.68
/OE  (via drill 0.6)
  Top 0.254: v56.89,52.28 54.36,52.28 IC1.82
  Top 0.305: v56.89,52.28 U$2.41 | U$3.41 69.48,35.28 v71.54,35.28
  Bottom 0.254: v56.89,52.28 59.71,52.28 61.07,50.92 61.07,45.08 65.39,40.76 72,40.76 73.01,39.74 73.01,37.96 | v71.54,35.28 72.11,35.28 73.01,36.19 73.01,37.96 | 73.01,37.96 73.01,38.22
/RESET  (via drill 0.6)
  Top 0.254: R7.1 49.5,36.96 v50.16,36.96
  Top 0.406: JP6.1 53.43,15.61 52.18,15.61 50.78,17.02 50.78,22.78 50.18,23.38 43.58,23.38 43,22.8 R3.1 41.57,21.99 39.49,24.07 U$1.13
  Bottom 0.254: v50.16,36.96 44.22,31.02 44.22,24.86 50.41,18.67 50.41,17.82 52.64,15.58 JP6.1
  Bottom 0.406: JP7.6 12.46,15.71 13.58,14.6 15.86,14.6 17.13,13.33 51.21,13.33 JP6.1
/UB  (via drill 0.6)
  Top 0.254: v55.94,53.08 54.45,53.08 IC1.83
  Top 0.305: v55.94,53.08 U$2.40 | U$3.40 69.48,34.48 v70.54,34.48
  Bottom 0.254: v55.94,53.08 59.67,53.08 61.58,51.17 61.58,45.33 65.65,41.27 72.25,41.27 73.52,40 73.52,35.93 72.07,34.48 v70.54,34.48
/WE
  Top 0.254: U$2.17 70.65,62.68 77.08,56.25 77.08,45.33 73.01,41.27 67.17,41.27 65.65,39.74 65.65,33.39 63.61,31.36 63.61,29.58 58.95,24.92 U$3.17 56.09,24.92 50.41,30.6 50.41,32.12 IC1.57
A0
  Top 0.254: U$2.1 69.73,49.88 69.96,49.65 69.96,48.89 69.46,48.38 63.87,48.38 58.53,43.04 58.53,38.47 58.04,37.98 U$3.1 57.77,37.99 57.77,38.73 53.71,42.79 53.71,45.84 53.2,46.35 52.67,46.35 IC1.76
A1
  Top 0.254: U$2.2 70.2,50.68 70.47,50.41 70.47,48.63 69.71,47.87 | 69.71,47.87 69.46,47.87 | 69.71,47.87 64.12,47.87 59.04,42.79 59.04,37.2 58.76,36.92 U$3.2 58.01,36.95 57.26,36.95 56.5,37.71 56.5,38.73 52.03,43.2 IC1.75
A2
  Top 0.254: U$2.3 70.42,51.48 70.98,50.92 70.98,48.38 69.96,47.36 64.38,47.36 59.55,42.54 59.55,36.44 59.23,36.12 U$3.3 57.33,36.12 55.99,37.46 55.99,38.56 IC1.74
A3
  Top 0.254: U$2.4 70.38,52.28 71.49,51.17 71.49,48.12 70.22,46.85 64.63,46.85 60.06,42.28 60.06,36.19 59.19,35.32 U$3.4 57.37,35.32 55.49,37.2 55.49,38.36 IC1.73
A4
  Top 0.254: U$2.5 70.6,53.08 72,51.68 72,47.87 70.47,46.35 64.88,46.35 60.57,42.03 60.57,35.93 59.15,34.52 U$3.5 57.41,34.52 54.98,36.95 54.98,38.16 IC1.72
A5
  Top 0.254: U$2.18 70.61,63.48 77.58,56.51 77.58,45.08 73.27,40.76 69.96,40.76 | 69.96,40.76 69.46,40.76 | 69.96,40.76 67.42,40.76 66.15,39.49 66.15,33.14 64.12,31.11 64.12,29.33 58.91,24.12 U$3.18 56.12,24.12 49.9,30.34 49.9,31.93 IC1.56
A6
  Top 0.254: U$2.19 70.57,64.28 78.09,56.76 78.09,44.82 73.52,40.25 67.68,40.25 66.66,39.23 66.66,32.88 64.63,30.85 64.63,29.07 58.87,23.32 U$3.19 56.16,23.32 49.39,30.09 49.39,31.73 IC1.55
A7
  Top 0.254: U$2.20 70.53,65.08 78.6,57.01 78.6,44.57 73.77,39.74 67.93,39.74 67.17,38.98 67.17,32.63 65.14,30.6 65.14,28.82 58.84,22.52 U$3.20 56.2,22.52 48.88,29.84 48.88,31.53 IC1.54
A8
  Top 0.254: 67.68,38.22 67.68,32.38 65.65,30.34 65.65,28.57 58.8,21.72 U$3.21 56.24,21.72 48.37,29.58 48.37,31.33 IC1.53 | 67.68,38.22 67.68,38.47 | U$2.21 70.5,65.88 79.11,57.27 79.11,44.31 74.03,39.23 68.19,39.23 67.68,38.73 67.68,38.22
A9
  Top 0.254: U$2.22 70.46,66.68 79.62,57.52 79.62,44.06 74.28,38.73 68.44,38.73 68.19,38.47 68.19,32.12 66.15,30.09 66.15,28.31 58.76,20.92 U$3.22 56.28,20.92 47.87,29.33 47.87,31.13 IC1.52
A10  (via drill 0.6)
  Top 0.254: v56.89,66.68 55.5,66.68 51.17,62.35 51.17,61.11 IC1.99
  Top 0.305: v56.89,66.68 U$2.23 | U$3.23 69.48,20.88 v71.54,20.88
  Bottom 0.254: v56.89,66.68 59.54,66.68 63.61,62.6 63.61,61.59 65.65,59.55 65.65,57.78 68.69,54.73 68.69,48.89 69.2,48.38 75.81,48.38 80.63,43.55 80.63,32.38 78.85,30.6 78.85,28.82 76.82,26.79 76.82,25.77 71.93,20.88 v71.54,20.88
A11  (via drill 0.6)
  Top 0.254: v55.74,65.88 55.46,65.88 51.68,62.09 51.68,60.91 IC1.98
  Top 0.305: v55.74,65.88 U$2.24 | U$3.24 69.48,21.68 v70.54,21.68
  Bottom 0.254: v55.74,65.88 59.57,65.88 63.11,62.35 63.11,61.33 65.14,59.3 65.14,57.52 68.19,54.47 68.19,48.63 68.95,47.87 75.55,47.87 80.12,43.3 80.12,32.63 78.35,30.85 78.35,29.07 76.31,27.04 76.31,26.03 71.97,21.68 v70.54,21.68
A12  (via drill 0.6)
  Top 0.254: v56.89,65.08 55.42,65.08 52.18,61.84 52.18,60.71 IC1.97
  Top 0.305: v56.89,65.08 U$2.25 | U$3.25 69.48,22.48 v71.54,22.48
  Bottom 0.254: v56.89,65.08 59.61,65.08 62.6,62.09 62.6,61.08 64.63,59.05 64.63,57.27 67.68,54.22 67.68,48.38 68.69,47.36 69.2,47.36 | v71.54,22.48 72.01,22.48 75.81,26.28 75.81,27.3 77.84,29.33 77.84,31.11 79.62,32.88 79.62,43.04 75.3,47.36 69.2,47.36 | 69.2,47.36 69.71,47.36
A13  (via drill 0.6)
  Top 0.254: v55.74,64.28 55.39,64.28 52.69,61.59 52.69,60.51 IC1.96
  Top 0.305: v55.74,64.28 U$2.26 | U$3.26 69.48,23.28 v70.54,23.28
  Bottom 0.254: v55.74,64.28 59.65,64.28 62.09,61.84 62.09,60.82 64.12,58.79 64.12,57.01 67.17,53.97 67.17,48.12 68.44,46.85 75.04,46.85 79.11,42.79 79.11,33.14 77.33,31.36 77.33,29.58 75.3,27.55 75.3,26.53 72.04,23.28 v70.54,23.28
A14  (via drill 0.6)
  Top 0.254: v56.89,63.48 55.35,63.48 53.2,61.33 53.2,60.31 IC1.95
  Top 0.305: v56.89,63.48 U$2.27 | U$3.27 69.48,24.08 v71.54,24.08
  Bottom 0.254: v56.89,63.48 59.69,63.48 61.58,61.59 61.58,60.57 63.61,58.54 63.61,56.76 66.66,53.71 66.66,47.87 68.19,46.35 74.79,46.35 78.6,42.54 78.6,33.39 76.82,31.61 76.82,29.84 74.79,27.8 74.79,26.79 72.08,24.08 v71.54,24.08
A15  (via drill 0.6)
  Top 0.254: v55.94,51.48 54.27,51.48 IC1.81
  Top 0.305: v55.94,51.48 U$2.42 | U$3.42 69.48,36.08 v70.54,36.08
  Bottom 0.254: v55.94,51.48 59.75,51.48 60.57,50.66 60.57,44.82 65.14,40.25 71.74,40.25 72.5,39.49 72.5,36.44 72.14,36.08 v70.54,36.08
A16  (via drill 0.6)
  Top 0.254: v56.89,50.68 55.59,50.68 IC1.78
  Top 0.305: v56.89,50.68 U$2.43 | U$3.43 69.48,36.88 v71.54,36.88
  Bottom 0.254: v56.89,50.68 56.91,50.66 59.8,50.66 60.06,50.41 60.06,44.57 64.88,39.74 71.49,39.74 72,39.23 72,37.2 71.67,36.88 v71.54,36.88
A17  (via drill 0.6)
  Top 0.254: U$3.44 v70.46,37.72 v70.47,37.71 | IC1.77 51.67,46.09 55.49,49.9 v55.99,49.9
  Top 0.305: U$2.44 56.02,49.88 v55.99,49.9
  Bottom 0.254: v70.47,37.71 70.98,37.71 71.49,38.22 71.49,38.98 71.23,39.23 64.63,39.23 59.55,44.31 59.55,49.65 59.3,49.9 v55.99,49.9
B0
  Top 0.2: IC1.3 38.61,55.24 33.9,55.24 30.56,51.9 U$4.10
B1
  Top 0.2: IC1.4 38.41,54.73 33.9,54.73 30.67,51.5 U$4.9
B2
  Top 0.2: IC1.5 38.21,54.22 33.9,54.22 30.78,51.1 U$4.8
B3
  Top 0.2: IC1.6 38.01,53.71 33.9,53.71 30.88,50.7 U$4.7
B4
  Top 0.2: IC1.7 37.81,53.2 33.9,53.2 30.99,50.3 U$4.6
B5
  Top 0.2: IC1.8 37.61,52.7 33.9,52.7 31.1,49.9 U$4.5
B6
  Top 0.2: IC1.15 34.69,50.66 32.37,50.66 31.21,49.5 U$4.4
B7
  Top 0.2: IC1.16 34.5,50.16 32.37,50.16 31.32,49.1 U$4.3
B8
  Top 0.2: IC1.17 34.3,49.65 32.37,49.65 29.01,46.28 U$5.10
B9
  Top 0.2: IC1.18 34.1,49.14 32.37,49.14 29.12,45.88 U$5.9
B10
  Top 0.2: IC1.19 33.9,48.63 32.37,48.63 29.22,45.48 U$5.8
B11
  Top 0.2: IC1.20 33.7,48.12 32.37,48.12 29.33,45.08 U$5.7
B12
  Top 0.2: IC1.21 33.5,47.62 32.37,47.62 29.44,44.68 U$5.6
B13
  Top 0.2: U$5.5 29.48,44.28 31.18,42.58 31.93,42.58 IC1.26
B14
  Top 0.2: U$5.4 29.28,43.88 30.98,42.18 32.24,42.18 IC1.27
B15
  Top 0.2: U$5.3 29.08,43.48 30.78,41.78 32.54,41.78 IC1.28
B16
  Top 0.2: U$6.10 32.14,40.67 IC1.29
B17
  Top 0.2: U$6.9 32.45,40.27 IC1.30
B18
  Top 0.2: U$6.8 34.17,39.87 IC1.33
B19
  Top 0.2: U$6.7 34.48,39.47 IC1.34
B20
  Top 0.2: U$6.6 34.78,39.07 IC1.35
B21
  Top 0.2: U$6.5 35.09,38.67 IC1.36
B22
  Top 0.2: U$6.4 35.4,38.27 IC1.37
B23
  Top 0.2: U$6.3 35.7,37.87 IC1.38
D1
  Top 0.254: U$2.7 70.52,54.68 73.01,52.19 73.01,47.36 70.98,45.33 65.14,45.33 61.58,41.77 61.58,35.42 59.08,32.92 U$3.7 58.01,32.88 55.74,32.88 54.47,34.15 54.47,37.96 IC1.71
D2
  Top 0.254: U$2.8 70.48,55.48 73.52,52.44 73.52,47.11 71.23,44.82 65.39,44.82 62.09,41.52 62.09,35.17 59.04,32.12 U$3.8 55.74,32.12 53.96,33.9 53.96,37.76 IC1.70
D3
  Top 0.254: U$2.9 70.44,56.28 74.03,52.7 74.03,46.85 71.49,44.31 69.71,44.31 | 69.71,44.31 69.46,44.31 | 69.71,44.31 65.65,44.31 62.6,41.27 62.6,34.92 59,31.32 U$3.9 55.78,31.32 53.45,33.65 53.45,37.56 IC1.69
D4
  Top 0.254: 58.53,30.52 U$3.10 | 58.53,30.52 58.96,30.52 63.11,34.66 63.11,41.01 65.9,43.81 71.74,43.81 74.54,46.6 74.54,52.95 70.41,57.08 U$2.10 | IC1.68 52.95,37.36 52.95,33.39 55.82,30.52 58.53,30.52
D5
  Top 0.254: U$2.13 70.8,59.48 75.04,55.24 75.04,46.35 72,43.3 66.15,43.3 63.61,40.76 63.61,34.41 61.58,32.38 61.58,30.6 59.1,28.12 U$3.13 55.93,28.12 52.44,31.61 52.44,37.16 IC1.67
D6
  Top 0.254: U$2.14 70.76,60.28 75.55,55.49 75.55,46.09 72.25,42.79 66.41,42.79 64.12,40.5 64.12,34.15 62.09,32.12 62.09,30.34 59.06,27.32 U$3.14 55.97,27.32 51.93,31.36 51.93,36.96 IC1.66
D7
  Top 0.254: U$2.15 70.72,61.08 76.06,55.74 76.06,45.84 72.5,42.28 66.66,42.28 64.63,40.25 64.63,33.9 62.6,31.87 62.6,30.09 59.03,26.52 U$3.15 56.01,26.52 51.42,31.11 51.42,33.94 IC1.61
D8
  Top 0.254: U$3.16 58.53,25.72 | 58.53,25.72 58.99,25.72 63.11,29.84 63.11,31.61 65.14,33.65 65.14,40 66.92,41.77 72.76,41.77 76.57,45.58 76.57,56 70.69,61.88 U$2.16 | IC1.58 50.91,32.32 50.91,30.85 56.05,25.72 58.53,25.72
D9  (via drill 0.6)
  Top 0.254: v56.89,61.88 55.27,61.88 53.71,60.32 53.71,58.7 IC1.92
  Top 0.305: v56.89,61.88 U$2.29 | U$3.29 69.48,25.68 v71.54,25.68
  Bottom 0.254: v56.89,61.88 59.51,61.88 63.11,58.28 63.11,56.51 66.15,53.46 66.15,47.62 67.93,45.84 74.54,45.84 78.09,42.28 78.09,33.65 76.31,31.87 76.31,30.09 71.9,25.68 v71.54,25.68
D10  (via drill 0.6)
  Top 0.254: v55.74,61.08 55.23,61.08 54.22,60.06 54.22,58.5 IC1.91
  Top 0.305: v55.74,61.08 U$2.30 | U$3.30 69.48,26.48 v70.54,26.48
  Bottom 0.254: v55.74,61.08 59.55,61.08 62.6,58.03 62.6,56.25 65.65,53.2 65.65,47.36 67.68,45.33 74.28,45.33 77.58,42.03 77.58,33.9 75.81,32.12 75.81,30.34 71.94,26.48 v70.54,26.48
D11  (via drill 0.6)
  Top 0.254: v56.89,60.28 55.2,60.28 54.72,59.81 54.72,58.3 IC1.90
  Top 0.305: v56.89,60.28 U$2.31 | U$3.31 69.48,27.28 v71.54,27.28
  Bottom 0.254: v56.89,60.28 59.59,60.28 62.09,57.78 62.09,56 65.14,52.95 65.14,47.11 67.42,44.82 74.03,44.82 77.08,41.77 77.08,34.15 75.3,32.38 75.3,30.6 71.98,27.28 v71.54,27.28
D12  (via drill 0.6)
  Top 0.254: v55.74,59.48 55.74,58.61 IC1.89
  Top 0.305: v55.74,59.48 U$2.32 | U$3.32 69.48,28.08 v70.54,28.08
  Bottom 0.254: v55.74,59.48 59.62,59.48 61.58,57.52 61.58,55.74 64.63,52.7 64.63,46.85 67.17,44.31 73.77,44.31 76.57,41.52 76.57,34.41 74.79,32.63 74.79,30.85 72.02,28.08 v70.54,28.08
D13  (via drill 0.6)
  Top 0.254: v56.89,57.08 54.91,57.08 IC1.88
  Top 0.305: v56.89,57.08 U$2.35 | U$3.35 69.48,30.48 v71.54,30.48
  Bottom 0.254: v56.89,57.08 59.48,57.08 64.12,52.44 64.12,46.6 66.92,43.81 73.52,43.81 76.06,41.27 76.06,34.66 71.88,30.48 v71.54,30.48
D14  (via drill 0.6)
  Top 0.254: v55.74,56.28 54.82,56.28 IC1.87
  Top 0.305: v55.74,56.28 U$2.36 | U$3.36 69.48,31.28 v70.54,31.28
  Bottom 0.254: v55.74,56.28 59.52,56.28 63.61,52.19 63.61,46.35 66.66,43.3 73.27,43.3 75.55,41.01 75.55,34.92 71.92,31.28 v70.54,31.28
D15  (via drill 0.6)
  Top 0.254: v56.89,55.48 54.73,55.48 IC1.86
  Top 0.305: v56.89,55.48 U$2.37 | U$3.37 69.48,32.08 v71.54,32.08
  Bottom 0.254: v56.89,55.48 59.56,55.48 63.11,51.93 63.11,46.09 66.41,42.79 73.01,42.79 75.04,40.76 75.04,35.17 71.95,32.08 v71.54,32.08
D16  (via drill 0.6)
  Top 0.254: v55.94,54.68 54.64,54.68 IC1.85
  Top 0.305: v55.94,54.68 U$2.38 | U$3.38 69.48,32.88 v70.54,32.88
  Bottom 0.254: v55.94,54.68 59.6,54.68 62.6,51.68 62.6,45.84 66.15,42.28 72.76,42.28 74.54,40.5 74.54,35.42 71.99,32.88 v70.54,32.88
DIR
  Top 0.2: IC1.2 38.81,55.74 33.9,55.74 31.36,53.2 28.82,53.2 | 28.82,53.24 28.82,53.2 | 28.82,53.2 28.24,53.78 27.38,53.78 25.38,51.78 25.38,49.58 26.26,48.7 U$4.2 28.46,48.7 28.78,48.38 28.78,48.18 28.38,47.78 26.18,47.78 25.38,46.98 25.38,43.98 26.28,43.08 U$5.2 28.48,43.08 28.78,42.78 28.78,42.58 28.38,42.18 26.18,42.18 25.38,41.38 25.38,38.38 26.29,37.47 U$6.2
GND  (via drill 0.6)
  Top 0.2: U$1.23 36.56,33.07 IC1.46 | U$4.12 27.3,52.7 27.18,52.58 | U$4.11 27.3,52.3 27.18,52.18 | U$5.12 27.08,47.08 26.98,46.98 | U$5.11 27.08,46.68 26.98,46.78 | U$6.11 27.18,41.07 27.18,41.47 U$6.12 | U$4.22 21.7,49.1 21.38,48.78 | U$5.22 21.68,43.48 21.38,43.18 | U$6.22 21.67,37.87 21.38,37.58
  Top 0.254: IC1.11 39.23,48.96 | 39.23,48.96 v39.23,48.89 | IC1.10 39.23,49.66 39.23,48.96 | IC1.32 35.88,42.28 v36.69,42.28 | IC1.46 40.95,37.46 v42.02,37.46 | IC1.60 45.33,39.33 v45.33,40 | IC1.65 47.1,41.08 v47.1,41.77 | IC1.79 49.39,45.19 v49.39,44.06 | IC1.93 43.8,49.5 v43.8,48.38
  Top 0.305: U$1.23 36.04,28.67 v35.67,28.31 | U$1.15 36.03,25.67 v35.67,26.03 | U$1.5 31.24,23.35 v30.85,23.74 | U$1.43 27.11,24.07 v28.31,25.26 | U$1.35 27.42,30.47 v28.09,29.58
  Top 0.406: U$2.34 61.8,57.88 62.48,57.2 67.54,57.2 v67.76,56.98 | U$2.12 68.04,58.68 v67.1,59.62 | 22.67,8.07 22.58,7.98
  Bottom 0.406: v67.1,59.62 67.1,57.64 v67.76,56.98
  other vias: 37.62,47.3 21.34,36.4 56.32,29.48 66.88,21.78 56.28,19.16 21.32,47.78 21.32,42.08 18.04,57.2 51.26,65.12 26.72,40.48 26.72,46.08 26.72,51.48 28.14,36.2 34.28,5.38 24.28,5.38 29.12,54.48
  pour Bottom: 50.99,44.36 42.15,35.52 33.31,44.36 42.15,53.2
  pour Bottom: 27.55,31.87 36.69,31.87 36.69,22.72 27.55,22.72
  pour Top: 0.88,69.96 81.18,69.96 81.18,0.88 0.88,0.88
  pour Bottom: 21.08,55.22 29.86,55.22 29.86,47.1 28.84,47.1 28.84,35.72 20.68,35.72
  pour Bottom: 73.04,68.2 73.04,17.28 49.5,17.28 49.5,68.2
  pour Bottom: 20.9,48.84 16.94,48.84 16.94,58.08 18.92,58.08 18.92,55.24 20.9,55.24
  pour Bottom: 23.58,9.58 35.18,9.58 35.18,0.78 23.58,0.78
IA0
  Top 0.2: JP2.26 13.53,58.03 15.61,58.03 16.37,57.27 16.37,56.51 20.58,52.3 U$4.14
IA1
  Top 0.2: JP2.25 14.9,56.76 15.35,56.76 20.21,51.9 U$4.15
IA2
  Top 0.2: JP2.24 13.53,55.49 15.86,55.49 19.85,51.5 U$4.16
IA3
  Top 0.2: JP2.23 14.9,54.22 16.37,54.22 19.49,51.1 U$4.17
IA4
  Top 0.2: JP2.22 13.53,52.95 16.88,52.95 19.13,50.7 U$4.18
IA5
  Top 0.2: JP2.21 14.9,51.68 17.39,51.68 18.77,50.3 U$4.19
IA6
  Top 0.2: JP2.20 13.53,50.41 17.89,50.41 18.4,49.9 U$4.20
IA7
  Top 0.2: JP2.19 14.9,49.14 18.4,49.14 18.76,49.5 U$4.21
IA8
  Top 0.2: JP2.18 13.53,47.87 19.67,47.87 20.86,46.68 U$5.14
IA9
  Top 0.2: JP2.17 14.9,46.6 20.18,46.6 20.5,46.28 U$5.15
IA10
  Top 0.2: JP2.16 13.53,45.33 17.64,45.33 18.19,45.88 U$5.16
IA11
  Top 0.2: JP2.15 14.9,44.06 17.13,44.06 18.56,45.48 U$5.17
IA12
  Top 0.2: JP2.14 13.53,42.79 16.62,42.79 18.92,45.08 U$5.18
IA13
  Top 0.2: JP2.13 14.9,41.52 16.12,41.52 19.28,44.68 U$5.19
IA14
  Top 0.2: JP2.12 13.53,40.25 15.61,40.25 19.64,44.28 U$5.20
IA15
  Top 0.2: JP2.11 15.06,39.23 15.35,39.23 20,43.88 U$5.21
IA16
  Top 0.2: U$6.14 19.02,41.07 15.73,37.78 13.6,37.78 JP2.10
IA17
  Top 0.2: U$6.15 19.32,40.67 16.23,37.58 16.23,36.88 15.84,36.49 JP2.9
IA18
  Top 0.2: U$6.16 19.62,40.27 16.93,37.58 16.93,36.18 15.93,35.18 13.54,35.18 JP2.8
IA19
  Top 0.2: U$6.17 19.92,39.87 17.63,37.58 17.63,35.38 16.2,33.95 JP2.7
IA20
  Top 0.2: U$6.18 20.22,39.47 18.33,37.58 18.33,34.33 16.68,32.68 16.18,32.68 13.58,32.68 JP2.6
IA21
  Top 0.2: U$6.19 20.52,39.07 19.03,37.58 19.03,33.23 17.21,31.41 JP2.5
IA22
  Top 0.2: U$6.20 20.82,38.67 19.73,37.58 19.73,32.68 17.23,30.18 13.62,30.18 JP2.4
IA23
  Top 0.2: U$6.21 21.12,38.27 20.43,37.58 20.43,32.23 17.07,28.87 JP2.3
N$2
  Top 0.406: X3.2 28.49,14.98 R2.1
N$3
  Top 0.406: U$1.3 29.64,18.92 R2.2
N$4
  Top 0.406: X3.3 29.29,12.77 R1.1
N$5
  Top 0.406: U$1.4 30.44,19.93 R1.2
N$6
  Top 1.016: IC3.2 IC3.TAB 24.12,64.54 JP1.1
N$7  (via drill 0.6)
  Top 0.254: IC1.23 34.4,45.3 v34.4,44.31
  Bottom 0.254: v34.4,44.31 32.63,42.54 32.63,40 41.01,31.61 41.01,22.76 JP5.3
N$8
  Top 1.016: D1.C 6.6,60.96 8.5,62.86 10.57,62.86 C5.+ 11.26,62.63 C2.1 15,62.34 IC3.3
N$9  (via drill 0.6)
  Top 0.254: IC1.22 35.17,45.24 v35.42,45.33
  Top 0.406: R8.1 45.98,21.38 47.98,19.38 47.98,18.37 JP5.1
  Bottom 0.254: v35.42,45.33 35.42,44.06 33.39,42.03 33.39,40 41.52,31.87 41.52,24.79 JP5.1
N$10  (via drill 0.6)
  Top 0.254: IC1.24 33.64,45.35 33.64,44.31 v32.12,44.31
  Top 0.406: JP5.5 44.18,17.05 44.18,14.78 44.58,14.38 48.78,14.38 49.58,15.18 49.58,21.38 R9.2
  Bottom 0.254: v32.12,44.31 31.86,44.06 31.86,40 40.5,31.36 40.5,21.45 42.88,19.08 JP5.5
N$11  (via drill 0.6)
  Top 0.254: IC1.25 32.2,46.09 31.61,46.09 30.85,45.33 v30.85,44.31
  Bottom 0.254: v30.85,44.31 30.85,40.25 39.99,31.11 39.99,18.69 JP5.7
N$12
  Top 0.305: 57.94,66.68 58.14,66.68
N$13
  Top 0.406: U$1.39 24.47,27.27 18.4,21.2 18.4,14.11 JP7.1
N$14
  Top 0.406: U$1.37 24.04,28.87 16.88,21.71 16.88,20.95 15.61,19.68 14.34,19.68 13.83,19.17 13.83,14.42 JP7.3
N$15
  Top 0.406: U$1.38 24.25,28.07 17.64,21.45 17.64,18.43 JP7.5
N$16
  Top 0.254: U$1.36 26.24,29.62 26.28,29.58
  Top 0.406: 26.28,29.58 23.71,29.58 JP7.9
N$17
  Top 0.254: IC1.62 48.48,37.58 R7.2
N$18
  Top 0.305: U$1.33 27.95,32.98 27.38,32.98 26.98,32.58 R10.1 25.98,32.63 25.98,33.98 25.85,34.11 JP8.1
N$23
  Top 0.406: U$1.17 42.67,27.27 Q1.3
N$24  (via drill 0.6)
  Top 0.254: IC1.12 36.05,51.43 v35.93,51.43 | v33.64,57.01 33.97,57.09 Q2.3
  Bottom 0.254: v35.93,51.43 33.64,53.71 v33.64,57.01
N$25
  Top 1.016: R4.1 47.36,64.89 47.18,65.06 LED1.A
N$26
  Top 0.406: U$1.40 24.69,26.47 20.43,22.22 20.43,19.86 LED2.C
N$27
  Top 0.406: U$1.41 24.9,25.67 22.97,23.74 22.97,19.84 LED3.C
N$28
  Top 0.406: LED2.A 20.46,15.18 17.38,12.1 17.38,7.98 R5.1
N$29
  Top 0.406: LED3.A 22.96,16.58 20.46,14.08 20.46,7.98 R6.1
PD0
  Top 0.254: U$1.18 38.63,28.07 44,33.44 44,34.29 IC1.51
PD1
  Top 0.254: IC1.50 40.5,34.18 40.5,30.6 38.77,28.87 U$1.19
PD2
  Top 0.254: IC1.49 39.99,34.38 39.99,30.85 38.81,29.67 U$1.20
PD3
  Top 0.254: IC1.48 39.48,34.58 39.48,31.11 38.85,30.47 U$1.21
PD4
  Top 0.254: U$1.25 34.44,33.77 IC1.42
PD5
  Top 0.254: IC1.47 38.98,34.78 38.98,31.61 38.47,31.11 38,31.11 U$1.22
PD6
  Top 0.254: IC1.41 34.11,34.15 33.9,34.15 33.64,33.89 U$1.26
PD7
  Top 0.254: IC1.40 33.91,34.66 33.64,34.66 32.84,33.86 U$1.27
PD_CLK  (via drill 0.6)
  Top 0.254: IC1.14 34.64,51.43 v34.4,51.43 | v29.58,35.68 28.84,34.94 U$1.32
  Bottom 0.254: v34.4,51.43 29.58,46.6 v29.58,35.68
PD_INT
  Top 0.254: IC1.39 33.71,35.17 33.39,35.17 32.04,33.82 U$1.28
TCK
  Top 0.406: U$1.9 34.44,19.9 35.93,18.41 35.93,18.15 39.74,14.34 41.41,14.34 JP5.6
TDI  (via drill 0.6)
  Top 0.406: U$1.10 35.24,21.27 35.17,21.2 35.17,20.44 v37.2,18.41
  Bottom 0.406: v37.2,18.41 38.47,17.14 44.09,17.14 JP5.4
TDO
  Top 0.406: U$1.11 36.04,20.84 36.69,20.18 40.25,20.18 41.52,18.91 41.52,16.99 JP5.8
TMS
  Top 0.406: JP5.2 46.63,17.14 46.63,19.13 45.78,19.98 41.98,19.98 38.69,23.27 U$1.12
V+
  Top 1.016: JP4.2 3.77,67.07 D1.A
VCC  (via drill 0.6)
  Top 0.406: X3.1 27.69,12.42 26.53,13.58 25.49,13.58 C1.2 25.47,14.8 27.55,16.88 | 27.55,16.88 33.13,16.88 33.9,17.64 33.9,19.17 32.88,20.18 32.88,21.42 U$1.7 | 27.55,16.88 v25.26,16.88
  Bottom 0.406: 26.94,59.46 JP1.3 26.86,59.46 24.78,57.38 24.78,42.58 24.58,42.38 24.58,17.56 v25.26,16.88
VCCIO
  Top 0.2: 23.58,43.18 23.48,43.08 U$5.23 U$5.24 | 23.58,48.78 23.5,48.7 U$4.23 U$4.24 | 23.58,37.78 | 23.58,37.47 U$6.23 U$6.24
  Top 0.406: JP3.2 23.58,48.78 23.58,43.18 23.58,37.78 | 23.58,37.47 23.58,37.78
  Bottom 0.406: JP3.2 23.58,57.6 22,59.18 15.02,59.18 JP2.27 JP2.28

### Text on the board
Top: PWR | PWR | EXT | + | + | USB | 1 | 5 | 3.3V | 23 | - | - | MEGA | JTAG | reset | CPLD | JTAG | Andreas Mueller HSA | USB-TPLE V 1.2